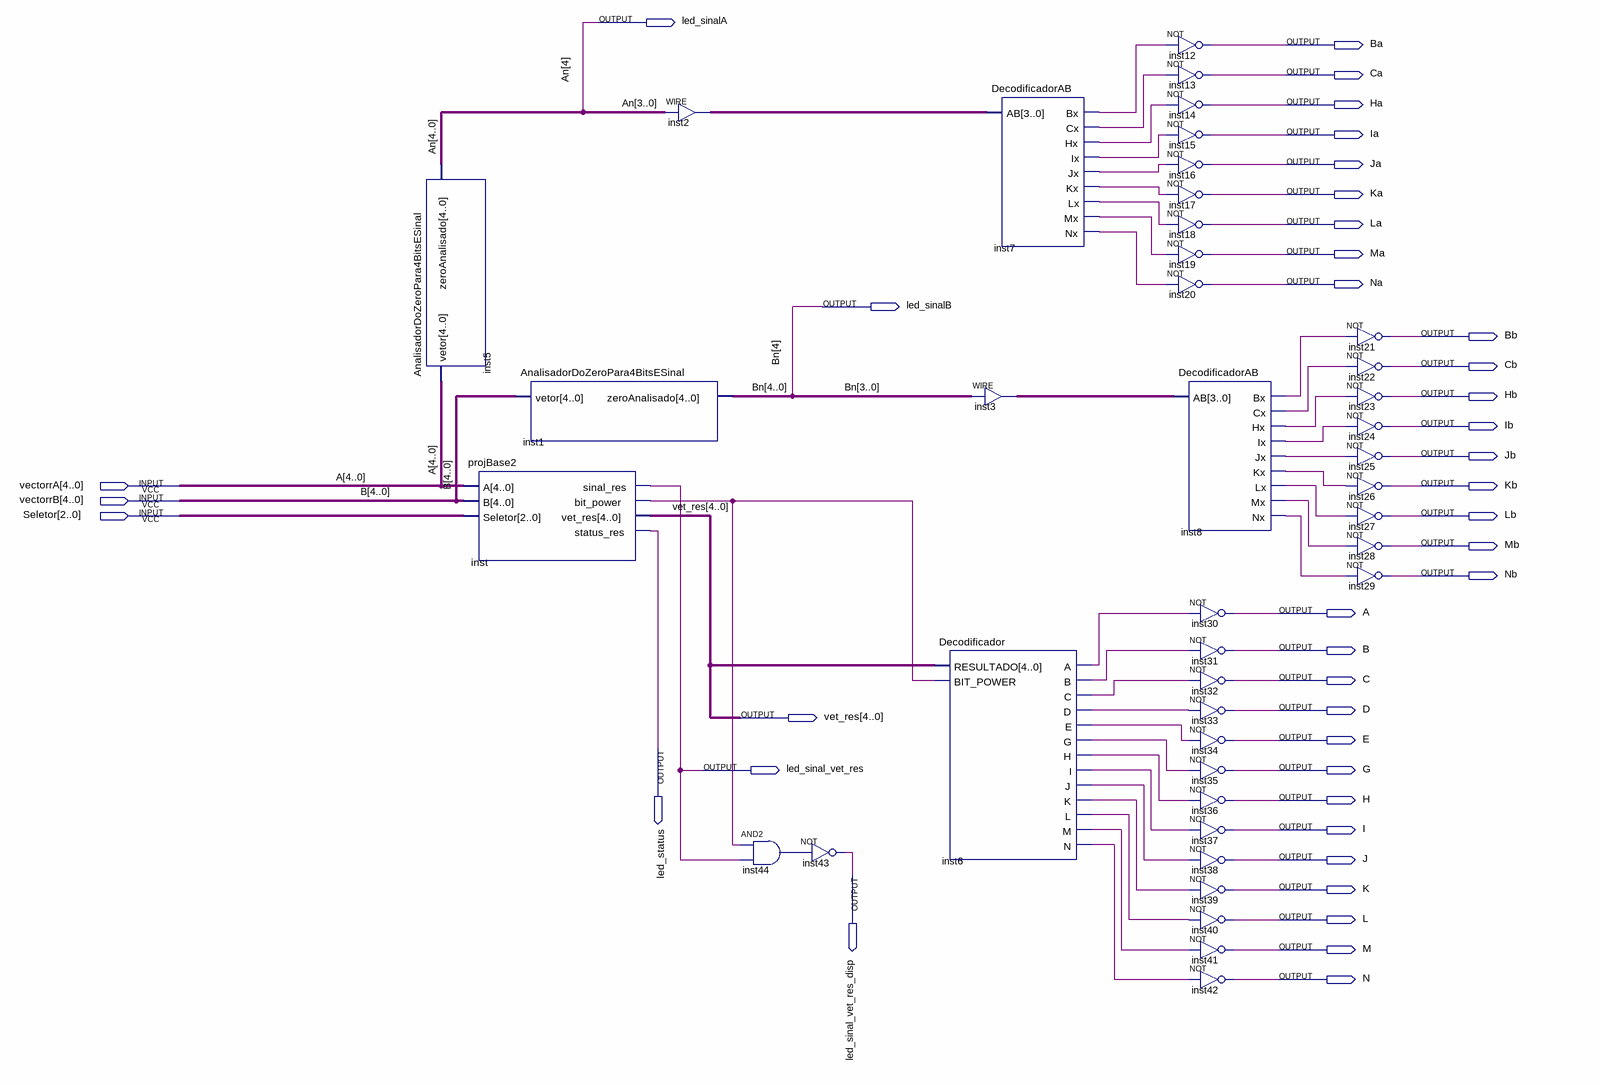
[diagram p0: schematic sheet]
// Quartus schematic projFinal.bdf as structural Verilog: 41 symbols, 40 pins
module projFinal (
  input  [4:0] vectorrA,
  input  [4:0] vectorrB,
  input  [2:0] Seletor,
  output led_sinalA,
  output Ba,
  output Ca,
  output Ha,
  output Ia,
  output Ja,
  output Ka,
  output La,
  output Ma,
  output Na,
  output led_sinalB,
  output Bb,
  output Cb,
  output Hb,
  output Ib,
  output Jb,
  output Kb,
  output Lb,
  output Mb,
  output Nb,
  output A,
  output B,
  output C,
  output D,
  output [4:0] vet_res,
  output E,
  output led_status,
  output led_sinal_vet_res,
  output G,
  output H,
  output I,
  output J,
  output led_sinal_vet_res_disp,
  output K,
  output L,
  output M,
  output N
);

  wire inst6_a, inst6_b, inst6_c, inst6_d, inst6_e, inst6_g, inst6_h, inst6_i, inst6_j, inst6_k, inst6_l,
       inst6_m, inst6_n, inst7_bx, inst7_cx, inst7_hx, inst7_ix, inst7_jx, inst7_kx, inst7_lx, inst7_mx,
       inst7_nx, inst8_bx, inst8_cx, inst8_hx, inst8_ix, inst8_jx, inst8_kx, inst8_lx, inst8_mx, inst8_nx,
       inst44_out, inst_bit_power;
  wire [3:0] An, Bn, inst2_out, inst3_out;

  AnalisadorDoZeroPara4BitsESinal inst5 (.vetor(vectorrA), .zeroAnalisado({led_sinalA, An}));
  projBase2 inst (
    .A(vectorrA), .B(vectorrB), .Seletor(Seletor), .sinal_res(led_sinal_vet_res), .bit_power(inst_bit_power),
    .vet_res(vet_res), .status_res(led_status));
  AnalisadorDoZeroPara4BitsESinal inst1 (.vetor(vectorrB), .zeroAnalisado({led_sinalB, Bn}));
  assign inst2_out = An;  // WIRE inst2
  and inst44 (inst44_out, inst_bit_power, led_sinal_vet_res);
  not inst43 (led_sinal_vet_res_disp, inst44_out);
  Decodificador inst6 (
    .RESULTADO(vet_res), .BIT_POWER(inst_bit_power), .A(inst6_a), .B(inst6_b), .C(inst6_c), .D(inst6_d),
    .E(inst6_e), .G(inst6_g), .H(inst6_h), .I(inst6_i), .J(inst6_j), .K(inst6_k), .L(inst6_l), .M(inst6_m),
    .N(inst6_n));
  DecodificadorAB inst7 (
    .AB(inst2_out), .Bx(inst7_bx), .Cx(inst7_cx), .Hx(inst7_hx), .Ix(inst7_ix), .Jx(inst7_jx), .Kx(inst7_kx),
    .Lx(inst7_lx), .Mx(inst7_mx), .Nx(inst7_nx));
  assign inst3_out = Bn;  // WIRE inst3
  not inst12 (Ba, inst7_bx);
  not inst13 (Ca, inst7_cx);
  not inst14 (Ha, inst7_hx);
  not inst15 (Ia, inst7_ix);
  not inst16 (Ja, inst7_jx);
  not inst17 (Ka, inst7_kx);
  not inst18 (La, inst7_lx);
  not inst19 (Ma, inst7_mx);
  not inst20 (Na, inst7_nx);
  DecodificadorAB inst8 (
    .AB(inst3_out), .Bx(inst8_bx), .Cx(inst8_cx), .Hx(inst8_hx), .Ix(inst8_ix), .Jx(inst8_jx), .Kx(inst8_kx),
    .Lx(inst8_lx), .Mx(inst8_mx), .Nx(inst8_nx));
  not inst30 (A, inst6_a);
  not inst31 (B, inst6_b);
  not inst32 (C, inst6_c);
  not inst33 (D, inst6_d);
  not inst34 (E, inst6_e);
  not inst35 (G, inst6_g);
  not inst36 (H, inst6_h);
  not inst37 (I, inst6_i);
  not inst38 (J, inst6_j);
  not inst39 (K, inst6_k);
  not inst40 (L, inst6_l);
  not inst41 (M, inst6_m);
  not inst42 (N, inst6_n);
  not inst21 (Bb, inst8_bx);
  not inst22 (Cb, inst8_cx);
  not inst23 (Hb, inst8_hx);
  not inst24 (Ib, inst8_ix);
  not inst25 (Jb, inst8_jx);
  not inst26 (Kb, inst8_kx);
  not inst27 (Lb, inst8_lx);
  not inst28 (Mb, inst8_mx);
  not inst29 (Nb, inst8_nx);

  // Other names for the same wires on the sheet: A[4:0] = vectorrA; B[4:0] = vectorrB; Bn[4] = led_sinalB;
  //   An[4] = led_sinalA
endmodule
